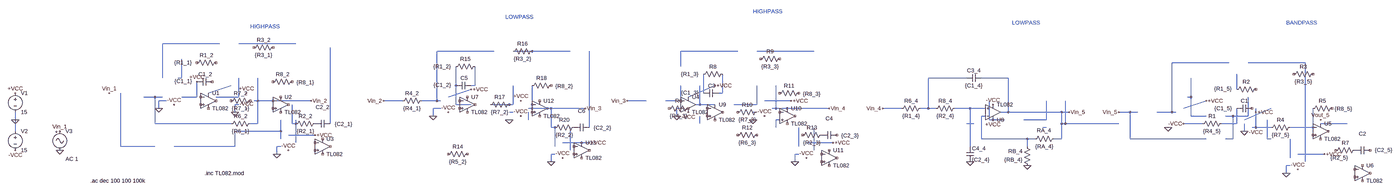
[diagram p0: schematic simulation_template.asc, whole sheet]
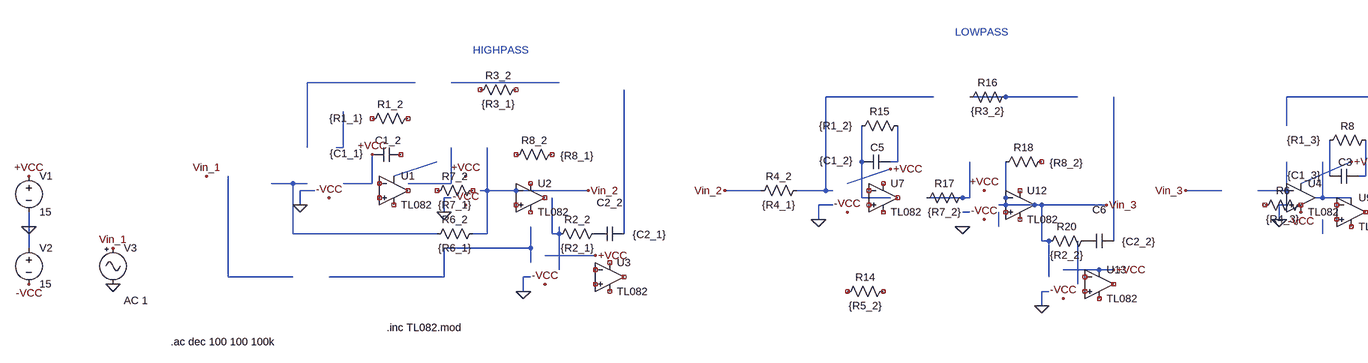
[diagram p1: schematic simulation_template.asc, part, row 1 of 1, column 1 of 2]
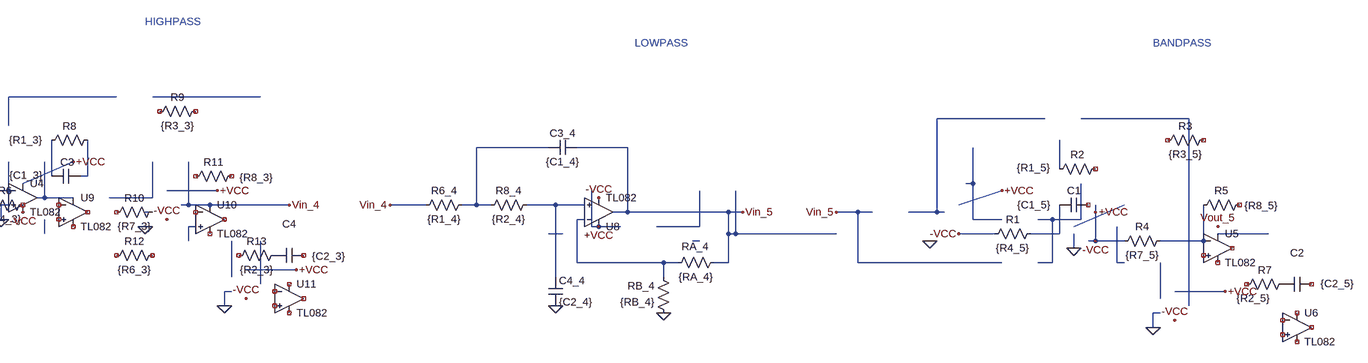
[diagram p2: schematic simulation_template.asc, part, row 1 of 1, column 2 of 2]
simulation_template.asc, the LTspice schematic file:
Version 4
SHEET 1 3956 1200
WIRE -768 -16 -1008 -16
WIRE -448 -16 -688 -16
WIRE 384 16 144 16
WIRE 704 16 464 16
WIRE 1408 16 1168 16
WIRE 1728 16 1488 16
WIRE -1008 48 -1008 -16
WIRE 3472 64 3232 64
WIRE 3792 64 3552 64
WIRE 144 80 144 16
WIRE 1168 80 1168 16
WIRE -1008 128 -1008 48
WIRE -928 128 -928 48
WIRE -928 128 -944 128
WIRE 2368 128 2208 128
WIRE 2544 128 2432 128
WIRE 3232 128 3232 64
WIRE 144 160 144 80
WIRE 224 160 224 80
WIRE 304 160 304 80
WIRE 304 160 288 160
WIRE 3504 176 3504 112
WIRE -816 192 -720 160
WIRE 1264 192 1264 112
WIRE 1344 192 1344 112
WIRE 1344 192 1328 192
WIRE -1040 208 -1088 208
WIRE -1008 208 -1040 208
WIRE -864 208 -864 144
WIRE -864 208 -928 208
WIRE -688 208 -688 128
WIRE -688 208 -784 208
WIRE 192 208 288 176
WIRE 1200 208 1312 160
WIRE 3232 208 3232 128
WIRE 3312 208 3312 128
WIRE 3312 208 3296 208
WIRE -992 224 -1024 224
WIRE -608 224 -608 128
WIRE -608 224 -624 224
WIRE -384 224 -608 224
WIRE -32 224 -80 224
WIRE 0 224 -32 224
WIRE 144 224 144 160
WIRE 144 224 80 224
WIRE 160 224 144 224
WIRE 1024 224 944 224
WIRE 1168 224 1168 160
WIRE 1168 224 1104 224
WIRE 1632 224 1520 224
WIRE -688 240 -704 240
WIRE 224 240 224 160
WIRE 288 240 224 240
WIRE 400 240 368 240
WIRE 464 240 464 160
WIRE 464 240 400 240
WIRE 1248 240 1248 160
WIRE 1248 240 1232 240
WIRE 1312 240 1248 240
WIRE 1488 240 1488 160
WIRE 1488 240 1392 240
WIRE -1024 256 -1024 224
WIRE 160 256 128 256
WIRE 544 256 544 160
WIRE 544 256 528 256
WIRE 768 256 544 256
WIRE 1168 256 1152 256
WIRE 1568 256 1568 160
WIRE 1568 256 1552 256
WIRE 1792 256 1568 256
WIRE 2096 256 2016 256
WIRE 2208 256 2208 128
WIRE 2208 256 2176 256
WIRE 2240 256 2208 256
WIRE 2384 256 2320 256
WIRE 2448 256 2384 256
WIRE 3280 256 3376 224
WIRE -704 272 -704 240
WIRE 464 272 448 272
WIRE 1488 272 1472 272
WIRE 2544 272 2544 128
WIRE 2544 272 2512 272
WIRE 2768 272 2544 272
WIRE 2800 272 2768 272
WIRE 3056 272 3008 272
WIRE 3088 272 3056 272
WIRE 3232 272 3232 208
WIRE 3232 272 3168 272
WIRE 3248 272 3232 272
WIRE 128 288 128 256
WIRE 1152 288 1152 256
WIRE 2448 288 2432 288
WIRE 3312 288 3312 208
WIRE 3376 288 3312 288
WIRE 3488 288 3456 288
WIRE 3552 288 3552 208
WIRE 3552 288 3488 288
WIRE -1792 304 -1792 272
WIRE 528 304 528 272
WIRE 1584 304 1568 304
WIRE 2464 304 2464 224
WIRE 2528 304 2464 304
WIRE 2704 304 2704 224
WIRE 2704 304 2608 304
WIRE 3536 304 3648 256
WIRE -1040 320 -1040 208
WIRE -720 320 -1040 320
WIRE -608 320 -608 224
WIRE -608 320 -640 320
WIRE -464 320 -464 240
WIRE -448 320 -464 320
WIRE -304 320 -304 0
WIRE 1248 320 1248 288
WIRE 2400 320 2368 320
WIRE 2784 320 2784 224
WIRE 2784 320 2768 320
WIRE 3008 320 2784 320
WIRE 3360 320 3280 320
WIRE 3504 320 3504 256
WIRE 3504 320 3440 320
WIRE 3968 320 3856 320
WIRE 624 336 624 256
WIRE 640 336 624 336
WIRE 784 336 784 16
WIRE 1568 336 1568 304
WIRE 2704 336 2688 336
WIRE 3584 336 3584 256
WIRE 3584 336 3568 336
WIRE 3648 336 3584 336
WIRE 3824 336 3824 256
WIRE 3824 336 3728 336
WIRE -1792 352 -1792 304
WIRE -512 352 -512 304
WIRE -512 352 -704 352
WIRE 3536 352 3536 320
WIRE -368 368 -480 368
WIRE -512 384 -512 352
WIRE 2432 384 2432 288
WIRE 2624 384 2432 384
WIRE 2656 384 2624 384
WIRE 2768 384 2768 272
WIRE 2768 384 2736 384
WIRE 3056 384 3056 272
WIRE 3376 384 3056 384
WIRE 3488 384 3488 288
WIRE 3488 384 3456 384
WIRE 3632 384 3632 304
WIRE 3648 384 3632 384
WIRE 3792 384 3792 64
WIRE -448 400 -448 304
WIRE 784 400 672 400
WIRE 1808 400 1696 400
WIRE -1184 416 -1184 192
WIRE -1040 416 -1184 416
WIRE -704 416 -704 352
WIRE -704 416 -960 416
WIRE -512 416 -528 416
WIRE 640 416 640 336
WIRE 1664 416 1664 336
WIRE 2384 416 2384 256
WIRE 2624 416 2624 384
WIRE 704 432 704 336
WIRE 1728 432 1728 336
WIRE -528 448 -528 416
WIRE 640 448 624 448
WIRE 1664 448 1648 448
WIRE 3872 448 3760 448
WIRE 3728 464 3728 384
WIRE 624 480 624 448
WIRE 1648 480 1648 448
WIRE 3792 480 3792 384
WIRE 3728 496 3712 496
WIRE 3712 528 3712 496
FLAG 128 288 0
FLAG 448 304 0
FLAG 624 480 0
FLAG 768 256 Vin_3
FLAG 1152 288 0
FLAG 1472 304 0
FLAG 1648 480 0
FLAG 1792 256 Vin_4
FLAG 288 176 +VCC
FLAG 192 272 -VCC
FLAG 496 224 +VCC
FLAG 496 288 -VCC
FLAG 784 400 +VCC
FLAG 672 464 -VCC
FLAG 2384 480 0
FLAG 2624 496 0
FLAG 2480 304 +VCC
FLAG 2480 240 -VCC
FLAG 2800 272 Vin_5
FLAG 1312 160 +VCC
FLAG 1200 272 -VCC
FLAG 1632 224 +VCC
FLAG 1520 288 -VCC
FLAG 1808 400 +VCC
FLAG 1696 464 -VCC
FLAG 3216 336 0
FLAG 3536 352 0
FLAG 3712 528 0
FLAG 3856 304 Vout_5
FLAG 3376 224 +VCC
FLAG 3280 320 -VCC
FLAG 3584 272 +VCC
FLAG 3584 336 -VCC
FLAG 3872 448 +VCC
FLAG 3760 512 -VCC
FLAG -1024 256 0
FLAG -704 272 0
FLAG -528 448 0
FLAG -1232 192 Vin_1
FLAG -384 224 Vin_2
FLAG -864 144 +VCC
FLAG -960 240 -VCC
FLAG -656 192 +VCC
FLAG -656 256 -VCC
FLAG -368 368 +VCC
FLAG -480 432 -VCC
FLAG -1792 304 0
FLAG -1792 192 +VCC
FLAG -1792 432 -VCC
FLAG -1440 432 0
FLAG -1440 352 Vin_1
FLAG -80 224 Vin_2
FLAG 944 224 Vin_3
FLAG 2016 256 Vin_4
FLAG 3008 272 Vin_5
SYMBOL res 96 208 R90
WINDOW 0 0 56 VBottom 2
WINDOW 3 32 56 VTop 2
SYMATTR InstName R4_2
SYMATTR Value {R4_1}
SYMBOL res -768 48 R90
WINDOW 0 0 56 VBottom 2
WINDOW 3 0 154 VTop 2
SYMATTR InstName R1_2
SYMATTR Value {R1_1}
SYMBOL cap -800 128 R90
WINDOW 0 0 29 VBottom 2
WINDOW 3 -2 121 VTop 2
SYMATTR InstName C1_2
SYMATTR Value {C1_1}
SYMBOL res -528 -16 R90
WINDOW 0 0 56 VBottom 2
WINDOW 3 32 56 VTop 2
SYMATTR InstName R3_2
SYMATTR Value {R3_1}
SYMBOL res -624 208 R90
WINDOW 0 0 56 VBottom 2
WINDOW 3 32 56 VTop 2
SYMATTR InstName R7_2
SYMATTR Value {R7_1}
SYMBOL res -448 128 R90
WINDOW 0 0 56 VBottom 2
WINDOW 3 3 -39 VTop 2
SYMATTR InstName R8_2
SYMATTR Value {R8_1}
SYMBOL res -624 304 R90
WINDOW 0 0 56 VBottom 2
WINDOW 3 32 56 VTop 2
SYMATTR InstName R6_2
SYMATTR Value {R6_1}
SYMBOL cap -304 304 R90
WINDOW 0 -38 32 VBottom 2
WINDOW 3 2 -56 VTop 2
SYMATTR InstName C2_2
SYMATTR Value {C2_1}
SYMBOL res -352 304 R90
WINDOW 0 0 56 VBottom 2
WINDOW 3 32 56 VTop 2
SYMATTR InstName R2_2
SYMATTR Value {R2_1}
SYMBOL res 3456 304 R90
WINDOW 0 0 56 VBottom 2
WINDOW 3 32 56 VTop 2
SYMATTR InstName R1
SYMATTR Value {R4_5}
SYMBOL res 3600 160 R90
WINDOW 0 0 56 VBottom 2
WINDOW 3 -2 154 VTop 2
SYMATTR InstName R2
SYMATTR Value {R1_5}
SYMBOL cap 3568 240 R90
WINDOW 0 0 32 VBottom 2
WINDOW 3 0 121 VTop 2
SYMATTR InstName C1
SYMATTR Value {C1_5}
SYMBOL res 3840 96 R90
WINDOW 0 0 56 VBottom 2
WINDOW 3 32 56 VTop 2
SYMATTR InstName R3
SYMATTR Value {R3_5}
SYMBOL res 3744 320 R90
WINDOW 0 0 56 VBottom 2
WINDOW 3 32 56 VTop 2
SYMATTR InstName R4
SYMATTR Value {R7_5}
SYMBOL res 3920 240 R90
WINDOW 0 0 56 VBottom 2
WINDOW 3 2 -32 VTop 2
SYMATTR InstName R5
SYMATTR Value {R8_5}
SYMBOL cap 4064 416 R90
WINDOW 0 -38 32 VBottom 2
WINDOW 3 -1 -57 VTop 2
SYMATTR InstName C2
SYMATTR Value {C2_5}
SYMBOL res 4016 416 R90
WINDOW 0 0 56 VBottom 2
WINDOW 3 32 81 VTop 2
SYMATTR InstName R7
SYMATTR Value {R2_5}
SYMBOL Opamps\\opamp2 -816 160 R0
SYMATTR InstName U1
SYMATTR Value TL082
SYMBOL Opamps\\opamp2 -512 176 R0
SYMATTR InstName U2
SYMATTR Value TL082
SYMBOL Opamps\\opamp2 -336 352 R0
SYMATTR InstName U3
SYMATTR Value TL082
SYMBOL res 2192 240 R90
WINDOW 0 0 56 VBottom 2
WINDOW 3 32 56 VTop 2
SYMATTR InstName R6_4
SYMATTR Value {R1_4}
SYMBOL res 2336 240 R90
WINDOW 0 0 56 VBottom 2
WINDOW 3 32 56 VTop 2
SYMATTR InstName R8_4
SYMATTR Value {R2_4}
SYMBOL cap 2432 112 R90
WINDOW 0 0 32 VBottom 2
WINDOW 3 32 32 VTop 2
SYMATTR InstName C3_4
SYMATTR Value {C1_4}
SYMBOL res 2640 512 R180
WINDOW 0 36 76 Left 2
WINDOW 3 36 40 Left 2
SYMATTR InstName RB_4
SYMATTR Value {RB_4}
SYMBOL res 2752 368 R90
WINDOW 0 -4 58 VBottom 2
WINDOW 3 32 56 VTop 2
SYMATTR InstName RA_4
SYMATTR Value {RA_4}
SYMBOL cap 2368 416 R0
SYMATTR InstName C4_4
SYMATTR Value {C2_4}
SYMBOL Opamps\\opamp2 2480 336 M180
SYMATTR InstName U8
SYMATTR Value TL082
SYMBOL Opamps\\opamp2 1200 176 R0
SYMATTR InstName U4
SYMATTR Value TL082
SYMBOL Opamps\\opamp2 3856 288 R0
SYMATTR InstName U5
SYMATTR Value TL082
SYMBOL Opamps\\opamp2 4032 464 R0
SYMATTR InstName U6
SYMATTR Value TL082
SYMBOL res 1216 240 R90
WINDOW 0 0 56 VBottom 2
WINDOW 3 32 56 VTop 2
SYMATTR InstName R6
SYMATTR Value {R4_3}
SYMBOL res 1360 96 R90
WINDOW 0 0 56 VBottom 2
WINDOW 3 0 154 VTop 2
SYMATTR InstName R8
SYMATTR Value {R1_3}
SYMBOL cap 1328 176 R90
WINDOW 0 0 29 VBottom 2
WINDOW 3 -2 121 VTop 2
SYMATTR InstName C3
SYMATTR Value {C1_3}
SYMBOL res 1600 32 R90
WINDOW 0 0 56 VBottom 2
WINDOW 3 32 56 VTop 2
SYMATTR InstName R9
SYMATTR Value {R3_3}
SYMBOL res 1504 256 R90
WINDOW 0 0 56 VBottom 2
WINDOW 3 32 56 VTop 2
SYMATTR InstName R10
SYMATTR Value {R7_3}
SYMBOL res 1680 176 R90
WINDOW 0 0 56 VBottom 2
WINDOW 3 3 -39 VTop 2
SYMATTR InstName R11
SYMATTR Value {R8_3}
SYMBOL res 1504 352 R90
WINDOW 0 0 56 VBottom 2
WINDOW 3 32 56 VTop 2
SYMATTR InstName R12
SYMATTR Value {R6_3}
SYMBOL cap 1824 352 R90
WINDOW 0 -38 32 VBottom 2
WINDOW 3 2 -56 VTop 2
SYMATTR InstName C4
SYMATTR Value {C2_3}
SYMBOL res 1776 352 R90
WINDOW 0 0 56 VBottom 2
WINDOW 3 32 56 VTop 2
SYMATTR InstName R13
SYMATTR Value {R2_3}
SYMBOL Opamps\\opamp2 1312 208 R0
SYMATTR InstName U9
SYMATTR Value TL082
SYMBOL Opamps\\opamp2 1616 224 R0
SYMATTR InstName U10
SYMATTR Value TL082
SYMBOL Opamps\\opamp2 1792 400 R0
SYMATTR InstName U11
SYMATTR Value TL082
SYMBOL res 320 64 R90
WINDOW 0 0 56 VBottom 2
WINDOW 3 0 154 VTop 2
SYMATTR InstName R15
SYMATTR Value {R1_2}
SYMBOL cap 288 144 R90
WINDOW 0 0 29 VBottom 2
WINDOW 3 -2 121 VTop 2
SYMATTR InstName C5
SYMATTR Value {C1_2}
SYMBOL res 560 0 R90
WINDOW 0 0 56 VBottom 2
WINDOW 3 32 56 VTop 2
SYMATTR InstName R16
SYMATTR Value {R3_2}
SYMBOL res 464 224 R90
WINDOW 0 0 56 VBottom 2
WINDOW 3 32 56 VTop 2
SYMATTR InstName R17
SYMATTR Value {R7_2}
SYMBOL res 640 144 R90
WINDOW 0 0 56 VBottom 2
WINDOW 3 3 -39 VTop 2
SYMATTR InstName R18
SYMATTR Value {R8_2}
SYMBOL cap 784 320 R90
WINDOW 0 -38 32 VBottom 2
WINDOW 3 2 -56 VTop 2
SYMATTR InstName C6
SYMATTR Value {C2_2}
SYMBOL res 736 320 R90
WINDOW 0 0 56 VBottom 2
WINDOW 3 32 56 VTop 2
SYMATTR InstName R20
SYMATTR Value {R2_2}
SYMBOL Opamps\\opamp2 272 176 R0
SYMATTR InstName U7
SYMATTR Value TL082
SYMBOL Opamps\\opamp2 576 192 R0
SYMATTR InstName U12
SYMATTR Value TL082
SYMBOL Opamps\\opamp2 752 368 R0
SYMATTR InstName U13
SYMATTR Value TL082
SYMBOL res 288 432 R90
WINDOW 0 0 56 VBottom 2
WINDOW 3 32 56 VTop 2
SYMATTR InstName R14
SYMATTR Value {R5_2}
SYMBOL voltage -1792 176 R0
WINDOW 123 0 0 Left 2
WINDOW 39 0 0 Left 2
SYMATTR InstName V1
SYMATTR Value 15
SYMBOL voltage -1792 336 R0
WINDOW 123 0 0 Left 2
WINDOW 39 0 0 Left 2
SYMATTR InstName V2
SYMATTR Value 15
SYMBOL Misc\\signal -1440 336 R0
WINDOW 123 24 132 Left 2
WINDOW 39 0 0 Left 2
SYMATTR Value2 AC 1
SYMATTR InstName V3
SYMATTR Value ""
TEXT -832 528 Left 2 !.inc TL082.mod
TEXT -1312 560 Left 2 !.ac dec 100 100 100k
TEXT 432 -128 Left 2 ;LOWPASS
TEXT -640 -88 Left 2 ;HIGHPASS
TEXT 2560 -104 Left 2 ;LOWPASS
TEXT 1472 -152 Left 2 ;HIGHPASS
TEXT 3712 -104 Left 2 ;BANDPASS

The netlist it stands for:
* simulation_template.asc
R4_2 N003 Vin_2 {R4_1}
R1_2 NC_01 NC_02 {R1_1}
C1_2 NC_03 -VCC {C1_1}
R3_2 NC_04 NC_05 {R3_1}
R7_2 NC_06 NC_07 {R7_1}
R8_2 NC_08 NC_09 {R8_1}
R6_2 Vin_2 N017 {R6_1}
C2_2 N034 P001 {C2_1}
R2_2 P001 N033 {R2_1}
R1 N037 -VCC {R4_5}
R2 NC_10 N013 {R1_5}
C1 NC_11 N037 {C1_5}
R3 NC_12 NC_13 {R3_5}
R4 N041 -VCC {R7_5}
R5 NC_14 N041 {R8_5}
C2 NC_15 P002 {C2_5}
R7 P002 NC_16 {R2_5}
* U1: TL082 (symbol Opamps\opamp2 not certain, pin order unknown); nets seen at it: N014
XU2 NC_21 Vin_2 NC_22 NC_23 NC_24 TL082  ; pins In+ In- V+ V- OUT
XU3 NC_25 NC_26 NC_27 NC_28 NC_29 TL082  ; pins In+ In- V+ V- OUT
R6_4 N010 Vin_4 {R1_4}
R8_4 N024 N010 {R2_4}
C3_4 Vin_5 N010 {C1_4}
RB_4 0 N027 {RB_4}
RA_4 Vin_5 N027 {RA_4}
C4_4 N024 0 {C2_4}
XU8 N024 N027 -VCC -VCC Vin_5 TL082  ; pins In+ In- V+ V- OUT
XU4 0 N020 -VCC -VCC N022 TL082  ; pins In+ In- V+ V- OUT
XU5 NC_30 N041 N038 NC_31 NC_32 TL082  ; pins In+ In- V+ V- OUT
XU6 NC_33 NC_34 NC_35 NC_36 NC_37 TL082  ; pins In+ In- V+ V- OUT
R6 NC_38 NC_39 {R4_3}
R8 N016 N015 {R1_3}
C3 N016 N015 {C1_3}
R9 NC_40 NC_41 {R3_3}
R10 N026 NC_42 {R7_3}
R11 NC_43 NC_44 {R8_3}
R12 NC_45 NC_46 {R6_3}
C4 NC_47 P003 {C2_3}
R13 P003 NC_48 {R2_3}
XU9 NC_49 NC_50 N022 NC_51 NC_52 TL082  ; pins In+ In- V+ V- OUT
XU10 N030 NC_53 Vin_4 NC_54 NC_55 TL082  ; pins In+ In- V+ V- OUT
XU11 NC_56 NC_57 NC_58 NC_59 NC_60 TL082  ; pins In+ In- V+ V- OUT
R15 N012 N011 {R1_2}
C5 N012 N011 {C1_2}
R16 N004 N004 {R3_2}
R17 N021 N021 {R7_2}
R18 NC_61 Vin_3 {R8_2}
C6 N039 P004 {C2_2}
R20 P004 Vin_3 {R2_2}
* U7: TL082 (symbol Opamps\opamp2 not certain, pin order unknown); nets seen at it: 
XU12 NC_67 Vin_3 NC_68 NC_69 Vin_3 TL082  ; pins In+ In- V+ V- OUT
XU13 NC_70 NC_71 -VCC NC_72 NC_73 TL082  ; pins In+ In- V+ V- OUT
R14 NC_74 NC_75 {R5_2}
V1 -VCC 0 15
V2 0 -VCC 15
V3 Vin_1 0 AC 1
.inc TL082.mod
.ac dec 100 100 100k
* LOWPASS
* HIGHPASS
* LOWPASS
* HIGHPASS
* BANDPASS
.backanno
.end